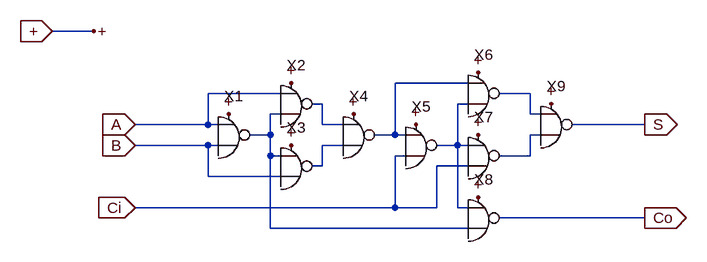
[diagram p0: schematic FA.asc]
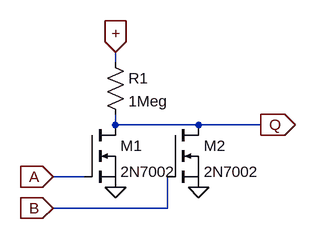
[diagram p1: sub-circuit nor2.asc]
FA.asc, the LTspice schematic file:
Version 4
SHEET 1 880 680
WIRE -128 -16 -192 -16
WIRE 448 64 336 64
WIRE 160 80 48 80
WIRE 544 80 496 80
WIRE 224 96 208 96
WIRE 448 96 432 96
WIRE 160 112 144 112
WIRE 544 112 544 80
WIRE 560 112 544 112
WIRE 48 128 48 80
WIRE 48 128 -64 128
WIRE 64 128 48 128
WIRE 224 128 224 96
WIRE 256 128 224 128
WIRE 720 128 608 128
WIRE 144 144 144 112
WIRE 144 144 112 144
WIRE 336 144 336 64
WIRE 336 144 304 144
WIRE 352 144 336 144
WIRE 560 144 544 144
WIRE 48 160 -64 160
WIRE 64 160 48 160
WIRE 256 160 224 160
WIRE 432 160 432 96
WIRE 432 160 400 160
WIRE 448 160 432 160
WIRE 144 176 144 144
WIRE 160 176 144 176
WIRE 352 176 336 176
WIRE 544 176 544 144
WIRE 544 176 496 176
WIRE 224 192 224 160
WIRE 224 192 208 192
WIRE 448 192 400 192
WIRE 48 208 48 160
WIRE 160 208 48 208
WIRE 336 256 336 176
WIRE 336 256 -64 256
WIRE 400 256 400 192
WIRE 400 256 336 256
WIRE 432 256 432 160
WIRE 448 256 432 256
WIRE 720 272 496 272
WIRE 144 288 144 176
WIRE 448 288 144 288
FLAG 80 112 +
FLAG 176 160 +
FLAG 176 64 +
FLAG 272 112 +
FLAG 464 48 +
FLAG 464 144 +
FLAG 464 240 +
FLAG 576 96 +
FLAG 368 128 +
FLAG -192 -16 +
IOPIN -192 -16 In
FLAG -128 -16 +
FLAG -64 128 A
IOPIN -64 128 In
FLAG -64 160 B
IOPIN -64 160 In
FLAG -64 256 Ci
IOPIN -64 256 In
FLAG 720 272 Co
IOPIN 720 272 Out
FLAG 720 128 S
IOPIN 720 128 Out
SYMBOL NOR2 96 144 R0
WINDOW 0 -8 -44 Bottom 2
SYMATTR InstName X1
SYMBOL NOR2 192 192 R0
WINDOW 0 -8 -44 Bottom 2
SYMATTR InstName X3
SYMBOL NOR2 288 144 R0
WINDOW 0 -8 -44 Bottom 2
SYMATTR InstName X4
SYMBOL NOR2 480 80 R0
WINDOW 0 -8 -44 Bottom 2
SYMATTR InstName X6
SYMBOL NOR2 480 176 R0
WINDOW 0 -8 -44 Bottom 2
SYMATTR InstName X7
SYMBOL NOR2 480 272 R0
WINDOW 0 -8 -44 Bottom 2
SYMATTR InstName X8
SYMBOL NOR2 592 128 R0
WINDOW 0 -8 -44 Bottom 2
SYMATTR InstName X9
SYMBOL NOR2 192 96 R0
WINDOW 0 -8 -44 Bottom 2
SYMATTR InstName X2
SYMBOL NOR2 384 160 R0
WINDOW 0 -8 -44 Bottom 2
SYMATTR InstName X5

nor2.asc, the sub-circuit schematic file:
Version 4
SHEET 1 880 680
WIRE 272 144 272 128
WIRE 272 240 272 224
WIRE 400 240 272 240
WIRE 496 240 400 240
WIRE 224 320 176 320
WIRE 352 368 352 320
WIRE 352 368 176 368
FLAG 272 336 0
FLAG 176 320 A
IOPIN 176 320 In
FLAG 496 240 Q
IOPIN 496 240 Out
FLAG 272 128 +
IOPIN 272 128 In
FLAG 400 336 0
FLAG 176 368 B
IOPIN 176 368 In
SYMBOL nmos 224 240 R0
SYMATTR InstName M1
SYMATTR Value 2N7002
SYMBOL res 256 128 R0
SYMATTR InstName R1
SYMATTR Value 1Meg
SYMBOL nmos 352 240 R0
SYMATTR InstName M2
SYMATTR Value 2N7002

The netlist it stands for:
* FA.asc
XX1 + A B N005 nor2
XX3 + N005 B N007 nor2
XX4 + N003 N007 N001 nor2
XX6 + N001 N004 N002 nor2
XX7 + N004 Ci N006 nor2
XX8 + N004 N005 Co nor2
XX9 + N002 N006 S nor2
XX2 + A N005 N003 nor2
XX5 + N001 Ci N004 nor2

* block symbol definitions
.subckt nor2 + A B Q
M1 Q A 0 0 2N7002
R1 + Q 1Meg
M2 Q B 0 0 2N7002
.ends nor2

.model NMOS NMOS
.model PMOS PMOS
.lib standard.mos
.backanno
.end